# Altium schematic sheet PowerOutCurrentMonitor.SchDoc
size A
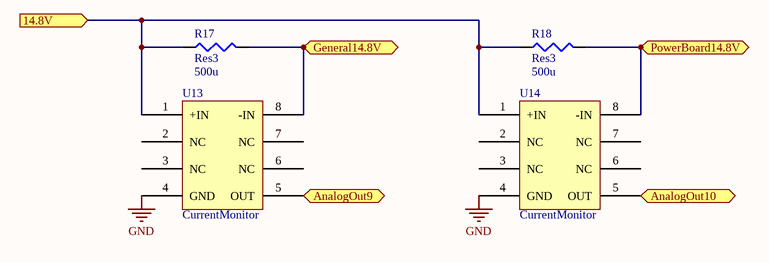
[diagram p0: PowerOutCurrentMonitor.SchDoc]

## Parts
R17  Res3  value 500u  [Resistor05MOHM]
R18  Res3  value 500u  [Resistor05MOHM]
U13  CurrentMonitor  [AD8217]
U14  CurrentMonitor  [AD8217]

## Ports
14.8V (in), AnalogOut9 (out), AnalogOut10 (out), General14.8V (out), PowerBoard14.8V (out)

## Nets
GND: U13.4(GND) U14.4(GND)
14.8V: R17.1 R18.1 U13.1(+IN) U14.1(+IN) ; port 14.8V
AnalogOut9: U13.5(OUT) ; port AnalogOut9
AnalogOut10: U14.5(OUT) ; port AnalogOut10
General14.8V: R17.2 U13.8(-IN) ; port General14.8V
PowerBoard14.8V: R18.2 U14.8(-IN) ; port PowerBoard14.8V

Not connected (* = marked no-connect by the designer): U13 2(NC) 3(NC) 6(NC) 7(NC); U14 2(NC) 3(NC) 6(NC) 7(NC)

## Library data of the parts
R17 R18 = Res3: Resistor; Published: 8-Jun-2000; LatestRevisionDate: 29-May-2009; LatestRevisionNote: IPC-7351 Footprint Added.; PackageReference: J1-0603; Publisher: Altium Limited; PackageDescription: Chip Resistor
U13 U14 = AD8217